# Altium schematic sheet ATRACK_WIFI_V1.SchDoc
size A4
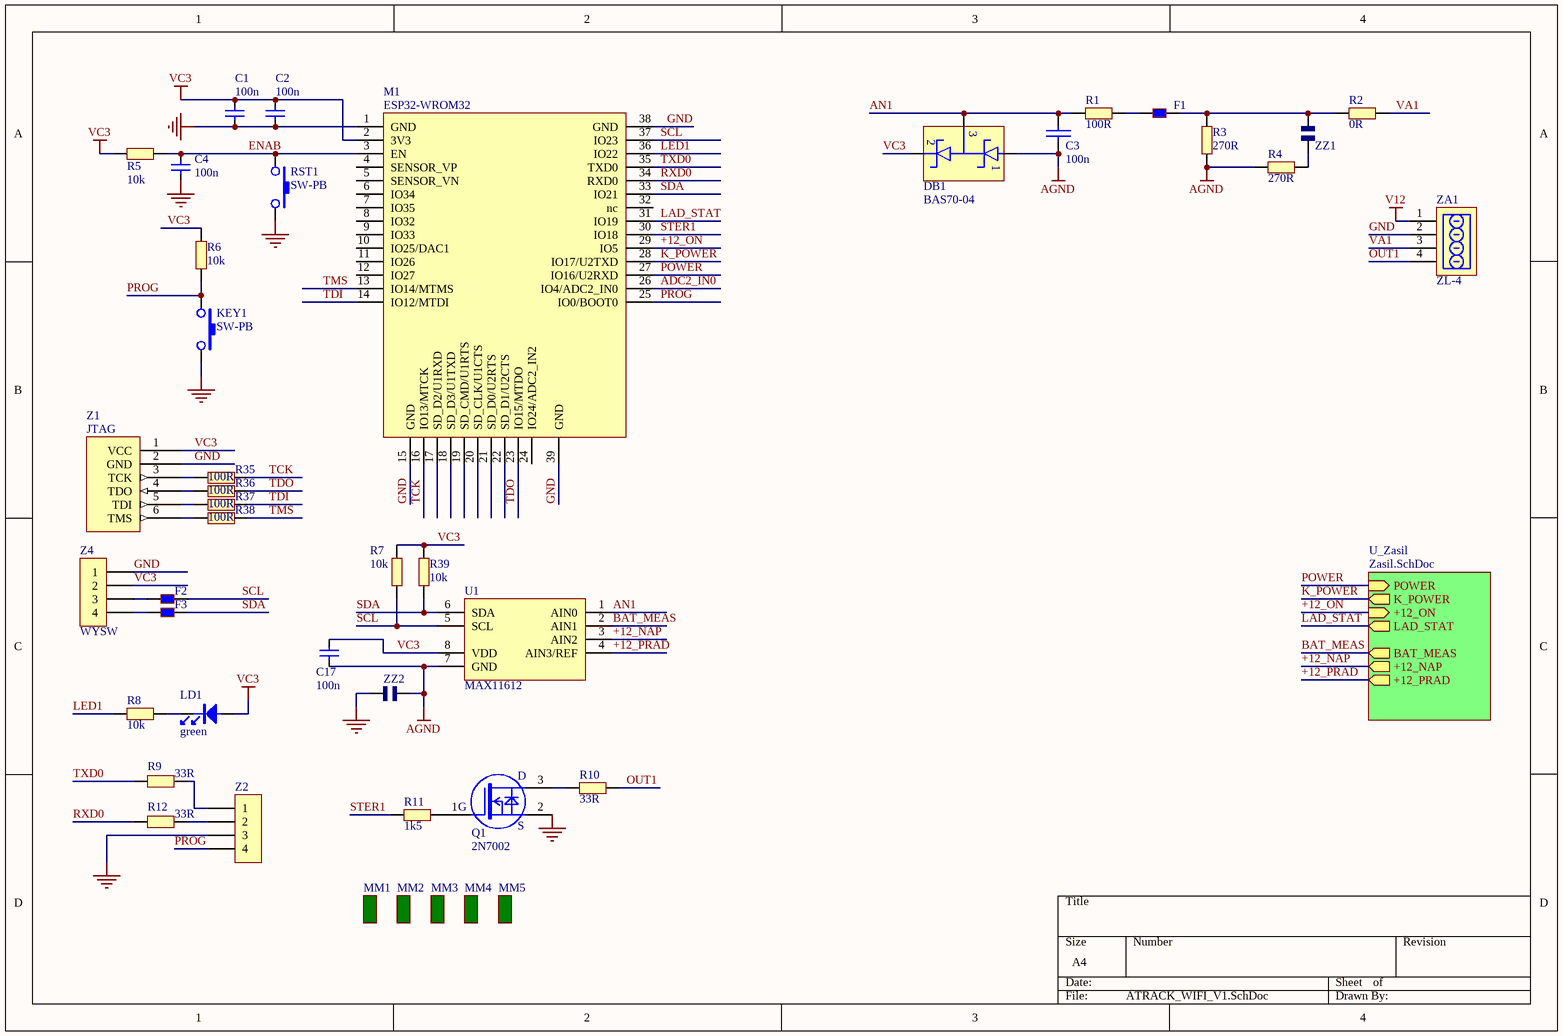
[diagram p0: ATRACK_WIFI_V1.SchDoc]

## Parts
C1  100n  [0603C]
C2  100n  [0603C]
C3  100n  [0603C]
C4  100n  [0603C]
C17  100n  [0603C]
DB1  BAS70-04  [SOT-23]
F1  (no value)  [0603L]
F2  BLM18BB141SN1D  [0603R]  (value not drawn)
F3  BLM18BB141SN1D  [0603R]  (value not drawn)
KEY1  SW-PB  [DTSM31N_2]
LD1  green  [0603D]
M1  ESP32-WROM32  [ESP32-WROM32]
MM1  (no value)  [REF_CIR]
MM2  (no value)  [REF_CIR]
MM3  (no value)  [REF_SQR]
MM4  (no value)  [REF_SQR]
MM5  (no value)  [PB_FREE_GRAF]
Q1  2N7002  [SOT23]
R1  100R  [0603R]
R2  0R  [0603R]
R3  270R  [0603R]
R4  270R  [0603R]
R5  10k  [0603R]
R6  10k  [0603R]
R7  10k  [0603R]
R8  10k  [0603R]
R9  33R  [0603R]
R10  33R  [0603R]
R11  1k5  [0603R]
R12  33R  [0603R]
R35  100R  [0603R]
R36  100R  [0603R]
R37  100R  [0603R]
R38  100R  [0603R]
R39  10k  [0603R]
RST1  SW-PB  [DTSM31N_2]
U1  MAX11612  [uMAX8]
Z1  JTAG  [PIN6]
Z2  (no value)  [PIN4]
Z4  WYSW  [UMATCH-4]
ZA1  ZL-4  [PIN4_2.5]
ZZ1  (no value)  [ZW1]
ZZ2  (no value)  [ZW1]

## Sub-sheets
U_Zasil = Zasil.SchDoc: LAD_STAT (out), POWER (in), K_POWER (out), BAT_MEAS (out), +12_ON (in), +12_NAP (out), +12_PRAD (out)

## Nets
AGND: C3.2 C17.2 DB1.1 R3.1 R4.2 U1.7(GND) ZZ2.1
GND: C1.1 C2.1 C4.2 KEY1.2 M1.1(GND) M1.15(GND) M1.38(GND) M1.39(GND) Q1.2(S) RST1.2 Z1.2(GND) Z2.3 Z4.1 ZA1.2 ZZ2.2
V12: ZA1.1
VC3: C1.2 C2.2 C17.1 DB1.2 LD1.A M1.2(3V3) R5.2 R6.2 R7.2 R39.2 U1.8(VDD) Z1.1(VCC) Z4.2
+12_NAP: U1.3(AIN2) ; sheet U_Zasil/+12_NAP
+12_ON: M1.29(IO5) ; sheet U_Zasil/+12_ON
+12_PRAD: U1.4(AIN3/REF) ; sheet U_Zasil/+12_PRAD
ADC2_IN0: M1.26(IO4/ADC2_IN0)
AN1: C3.1 DB1.3 R1.2 U1.1(AIN0)
BAT_MEAS: U1.2(AIN1) ; sheet U_Zasil/BAT_MEAS
ENAB: C4.1 M1.3(EN) R5.1 RST1.1
K_POWER: M1.28(IO17/U2TXD) ; sheet U_Zasil/K_POWER
LAD_STAT: M1.31(IO19) ; sheet U_Zasil/LAD_STAT
LED1: M1.36(IO22) R8.1
OUT1: R10.2 ZA1.4
POWER: M1.27(IO16/U2RXD) ; sheet U_Zasil/POWER
PROG: KEY1.1 M1.25(IO0/BOOT0) R6.1 Z2.4
RXD0: M1.34(RXD0) R12.2
SCL: F2.2 M1.37(IO23) R7.1 U1.5(SCL)
SDA: F3.2 M1.33(IO21) R39.1 U1.6(SDA)
STER1: M1.30(IO18) R11.1
TCK: M1.16(IO13/MTCK) R35.1
TDI: M1.14(IO12/MTDI) R37.1
TDO: M1.23(IO15/MTDO) R36.1
TMS: M1.13(IO14/MTMS) R38.1
TXD0: M1.35(TXD0) R9.2
VA1: R2.1 ZA1.3
NetF1_1: F1.1 R1.1
NetF1_2: F1.2 R2.2 R3.2 ZZ1.2
NetF2_1: F2.1 Z4.3
NetF3_1: F3.1 Z4.4
NetLD1_K: LD1.K R8.2
NetQ1_1: Q1.1 R11.2
NetQ1_3: Q1.3(D) R10.1
NetR4_1: R4.1 ZZ1.1
NetR9_1: R9.1 Z2.1
NetR12_1: R12.1 Z2.2
NetR35_2: R35.2 Z1.3(TCK)
NetR36_2: R36.2 Z1.4(TDO)
NetR37_2: R37.2 Z1.5(TDI)
NetR38_2: R38.2 Z1.6(TMS)

Not connected (* = marked no-connect by the designer): M1 4(SENSOR_VP) 5(SENSOR_VN) 6(IO34) 7(IO35) 8(IO32) 9(IO33) 10(IO25/DAC1) 11(IO26) 12(IO27) 17(SD_D2/U1RXD) 18(SD_D3/U1TXD) 19(SD_CMD/U1RTS) 20(SD_CLK/U1CTS) 21(SD_D0/U2RTS) 22(SD_D1/U2CTS) 24(IO24/ADC2_IN2) 32(nc)

## Notes on the sheet
- (in symbol MOSFET-P_1_1) G

## Library data of the parts
C1 C2 C4 C17 = CAP
C3 = CAP: Capacitor
F1-F3 = KORALIK: Koralik ferrytowy
LD1 = LED: Manuf_1: everlight; Manuf_Part_1: 19-213-R6C-AP1Q2B/3T; Description: LED,red,0603,19-213-R6C-AP1Q2B/3T,everlight; ECCN_US/EU: EAR99/NEC; Order: 19-213-R6C-AP1Q2B/3T
MM1-MM5 = MECH
Q1 = MOSFET-P_1_1
R1-R12 R35-R39 = RES3
Z1 = Pro1F9.tmp_JTAG_64
Z2 Z4 = CON4: Connector
ZZ1 ZZ2 = ZWORA